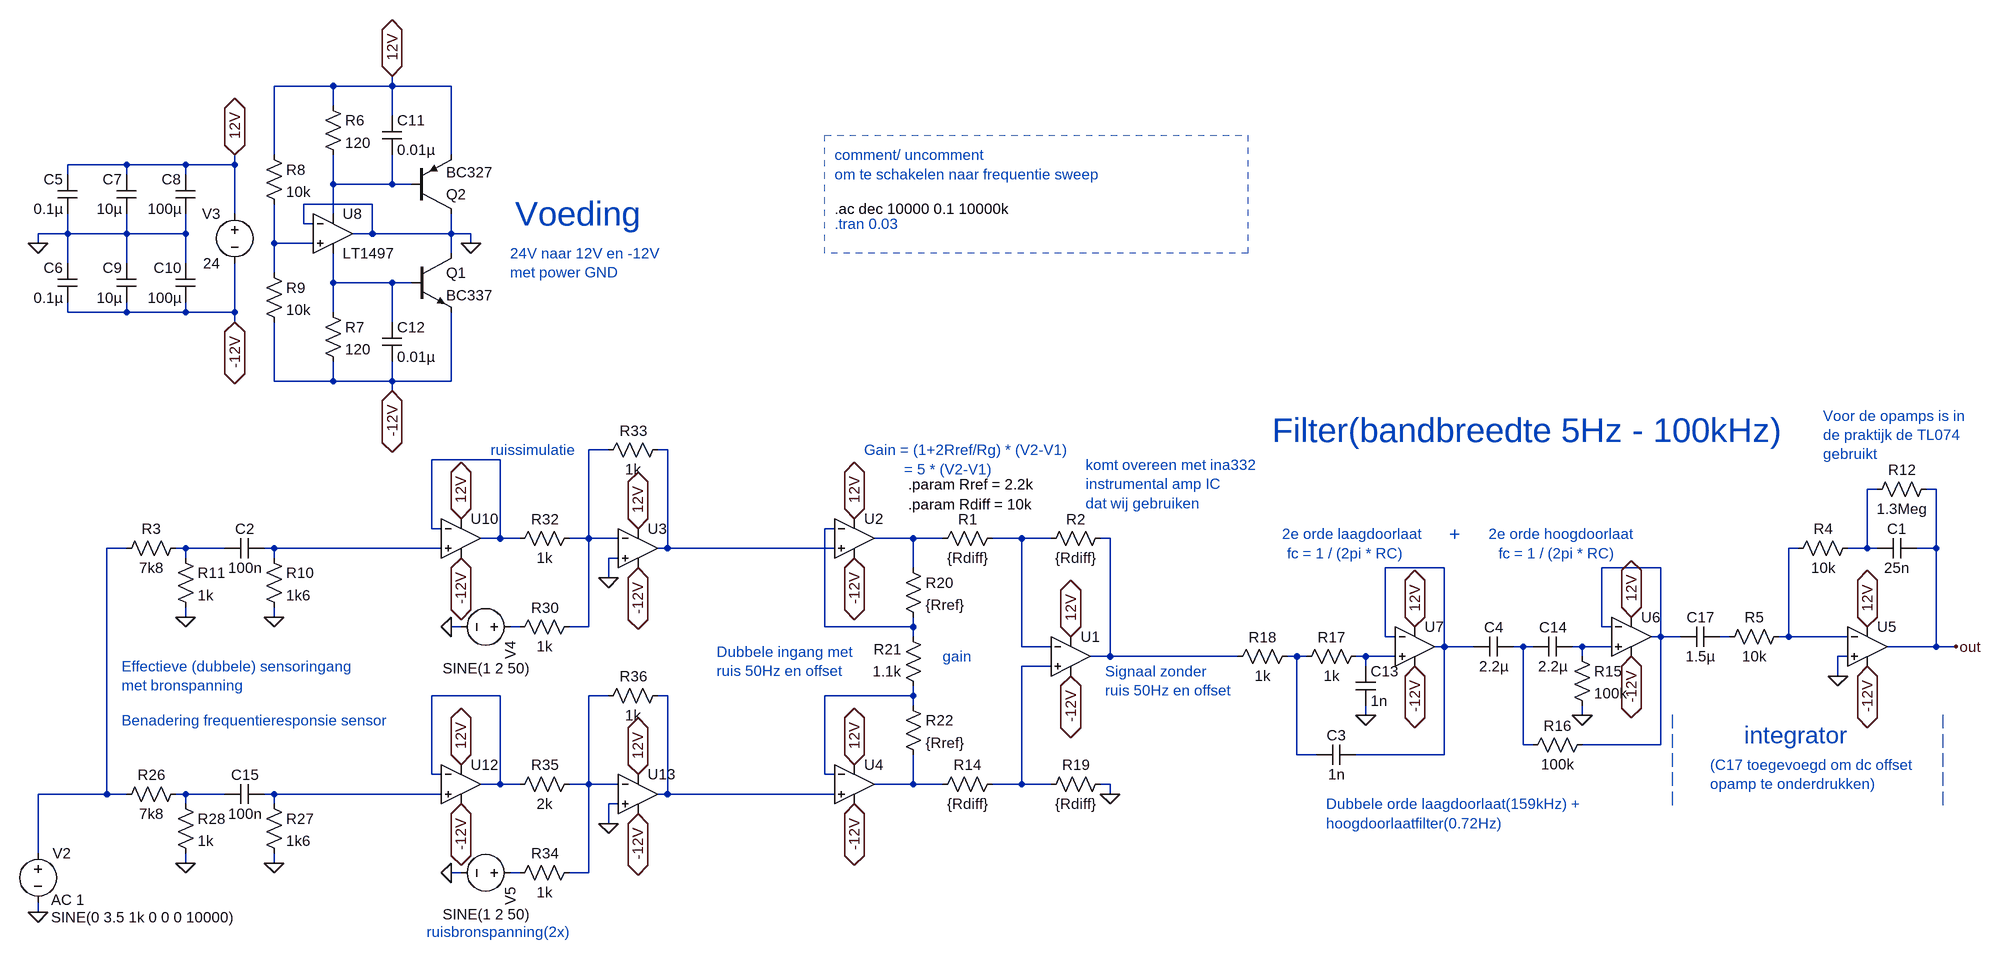
[diagram p0: schematic sensorsimulatie _5hz100khz_diff.asc]
sensorsimulatie _5hz100khz_diff.asc, the LTspice schematic file:
Version 4
SHEET 1 2408 680
WIRE -3392 -944 -3488 -944
WIRE -3296 -944 -3296 -960
WIRE -3296 -944 -3392 -944
WIRE -3200 -944 -3296 -944
WIRE -3392 -912 -3392 -944
WIRE -3296 -896 -3296 -944
WIRE -3488 -832 -3488 -944
WIRE -3200 -832 -3200 -944
WIRE -3728 -816 -3824 -816
WIRE -3632 -816 -3728 -816
WIRE -3552 -816 -3552 -832
WIRE -3552 -816 -3632 -816
WIRE -3824 -800 -3824 -816
WIRE -3728 -800 -3728 -816
WIRE -3632 -800 -3632 -816
WIRE -3392 -784 -3392 -832
WIRE -3296 -784 -3296 -832
WIRE -3296 -784 -3392 -784
WIRE -3264 -784 -3296 -784
WIRE -3328 -752 -3440 -752
WIRE -3552 -736 -3552 -816
WIRE -3392 -736 -3392 -784
WIRE -3440 -720 -3440 -752
WIRE -3424 -720 -3440 -720
WIRE -3824 -704 -3824 -736
WIRE -3824 -704 -3872 -704
WIRE -3728 -704 -3728 -736
WIRE -3728 -704 -3824 -704
WIRE -3632 -704 -3632 -736
WIRE -3632 -704 -3728 -704
WIRE -3328 -704 -3328 -752
WIRE -3328 -704 -3360 -704
WIRE -3200 -704 -3200 -736
WIRE -3200 -704 -3328 -704
WIRE -3168 -704 -3200 -704
WIRE -3872 -688 -3872 -704
WIRE -3488 -688 -3488 -752
WIRE -3424 -688 -3488 -688
WIRE -3168 -688 -3168 -704
WIRE -3200 -672 -3200 -704
WIRE -3824 -656 -3824 -704
WIRE -3728 -656 -3728 -704
WIRE -3632 -656 -3632 -704
WIRE -3488 -640 -3488 -688
WIRE -3392 -624 -3392 -672
WIRE -3296 -624 -3392 -624
WIRE -3264 -624 -3296 -624
WIRE -3824 -576 -3824 -592
WIRE -3728 -576 -3728 -592
WIRE -3728 -576 -3824 -576
WIRE -3632 -576 -3632 -592
WIRE -3632 -576 -3728 -576
WIRE -3552 -576 -3552 -656
WIRE -3552 -576 -3632 -576
WIRE -3392 -576 -3392 -624
WIRE -3552 -560 -3552 -576
WIRE -3296 -560 -3296 -624
WIRE -3488 -464 -3488 -560
WIRE -3392 -464 -3392 -496
WIRE -3392 -464 -3488 -464
WIRE -3296 -464 -3296 -496
WIRE -3296 -464 -3392 -464
WIRE -3200 -464 -3200 -576
WIRE -3200 -464 -3296 -464
WIRE -3296 -448 -3296 -464
WIRE -2944 -352 -2976 -352
WIRE -2848 -352 -2864 -352
WIRE -3120 -336 -3232 -336
WIRE -880 -288 -896 -288
WIRE -784 -288 -800 -288
WIRE -3232 -224 -3232 -336
WIRE -3216 -224 -3232 -224
WIRE -2576 -224 -2592 -224
WIRE -3120 -208 -3120 -336
WIRE -3120 -208 -3152 -208
WIRE -3088 -208 -3120 -208
WIRE -2976 -208 -2976 -352
WIRE -2976 -208 -3008 -208
WIRE -2928 -208 -2976 -208
WIRE -2448 -208 -2512 -208
WIRE -2400 -208 -2448 -208
WIRE -2272 -208 -2320 -208
WIRE -2224 -208 -2272 -208
WIRE -2128 -208 -2144 -208
WIRE -3728 -192 -3760 -192
WIRE -3632 -192 -3648 -192
WIRE -3568 -192 -3632 -192
WIRE -3488 -192 -3504 -192
WIRE -3216 -192 -3488 -192
WIRE -2848 -192 -2848 -352
WIRE -2848 -192 -2864 -192
WIRE -2576 -192 -2848 -192
WIRE -1008 -192 -1024 -192
WIRE -896 -192 -896 -288
WIRE -896 -192 -928 -192
WIRE -880 -192 -896 -192
WIRE -784 -192 -784 -288
WIRE -784 -192 -816 -192
WIRE -3632 -176 -3632 -192
WIRE -3488 -176 -3488 -192
WIRE -2928 -176 -2944 -176
WIRE -2448 -160 -2448 -208
WIRE -1584 -160 -1680 -160
WIRE -1232 -160 -1328 -160
WIRE -2944 -144 -2944 -176
WIRE -3632 -80 -3632 -96
WIRE -3488 -80 -3488 -96
WIRE -3184 -64 -3200 -64
WIRE -3088 -64 -3104 -64
WIRE -2976 -64 -2976 -208
WIRE -2976 -64 -3008 -64
WIRE -2592 -64 -2592 -224
WIRE -2448 -64 -2448 -80
WIRE -2448 -64 -2592 -64
WIRE -1328 -64 -1328 -160
WIRE -1312 -64 -1328 -64
WIRE -2448 -48 -2448 -64
WIRE -1680 -48 -1680 -160
WIRE -1664 -48 -1680 -48
WIRE -1232 -48 -1232 -160
WIRE -1232 -48 -1248 -48
WIRE -1200 -48 -1232 -48
WIRE -1120 -48 -1136 -48
WIRE -1024 -48 -1024 -192
WIRE -1024 -48 -1040 -48
WIRE -928 -48 -1024 -48
WIRE -2272 -32 -2272 -208
WIRE -2224 -32 -2272 -32
WIRE -1584 -32 -1584 -160
WIRE -1584 -32 -1600 -32
WIRE -1536 -32 -1584 -32
WIRE -1456 -32 -1472 -32
WIRE -1440 -32 -1456 -32
WIRE -1360 -32 -1376 -32
WIRE -1312 -32 -1360 -32
WIRE -784 -32 -784 -192
WIRE -784 -32 -864 -32
WIRE -752 -32 -784 -32
WIRE -2128 -16 -2128 -208
WIRE -2128 -16 -2160 -16
WIRE -1920 -16 -2128 -16
WIRE -1824 -16 -1840 -16
WIRE -1808 -16 -1824 -16
WIRE -1712 -16 -1728 -16
WIRE -1664 -16 -1712 -16
WIRE -1360 -16 -1360 -32
WIRE -928 -16 -944 -16
WIRE -2224 0 -2272 0
WIRE -1712 0 -1712 -16
WIRE -944 16 -944 -16
WIRE -3120 48 -3232 48
WIRE -2944 48 -2976 48
WIRE -2848 48 -2864 48
WIRE -2448 48 -2448 32
WIRE -2448 48 -2592 48
WIRE -2448 64 -2448 48
WIRE -1712 80 -1712 64
WIRE -1360 80 -1360 64
WIRE -1456 128 -1456 -32
WIRE -1440 128 -1456 128
WIRE -1232 128 -1232 -48
WIRE -1232 128 -1360 128
WIRE -1824 144 -1824 -16
WIRE -1792 144 -1824 144
WIRE -1584 144 -1584 -32
WIRE -1584 144 -1728 144
WIRE -3232 176 -3232 48
WIRE -3216 176 -3232 176
WIRE -2592 176 -2592 48
WIRE -2576 176 -2592 176
WIRE -3120 192 -3120 48
WIRE -3120 192 -3152 192
WIRE -3088 192 -3120 192
WIRE -2976 192 -2976 48
WIRE -2976 192 -3008 192
WIRE -2928 192 -2976 192
WIRE -2448 192 -2448 144
WIRE -2448 192 -2512 192
WIRE -2400 192 -2448 192
WIRE -2272 192 -2272 0
WIRE -2272 192 -2320 192
WIRE -2224 192 -2272 192
WIRE -2128 192 -2144 192
WIRE -3760 208 -3760 -192
WIRE -3760 208 -3872 208
WIRE -3728 208 -3760 208
WIRE -3632 208 -3648 208
WIRE -3568 208 -3632 208
WIRE -3488 208 -3504 208
WIRE -3216 208 -3488 208
WIRE -2848 208 -2848 48
WIRE -2848 208 -2864 208
WIRE -2576 208 -2848 208
WIRE -2128 208 -2128 192
WIRE -3632 224 -3632 208
WIRE -3488 224 -3488 208
WIRE -2928 224 -2944 224
WIRE -2944 256 -2944 224
WIRE -3872 304 -3872 208
WIRE -3632 320 -3632 304
WIRE -3488 320 -3488 304
WIRE -3184 336 -3200 336
WIRE -3088 336 -3104 336
WIRE -2976 336 -2976 192
WIRE -2976 336 -3008 336
WIRE -3872 400 -3872 384
FLAG -3552 -832 12V
IOPIN -3552 -832 BiDir
FLAG -3552 -560 -12V
IOPIN -3552 -560 BiDir
FLAG -3872 -688 0
FLAG -3488 -80 0
FLAG -3632 -80 0
FLAG -3872 400 0
FLAG -1280 -80 12V
IOPIN -1280 -80 BiDir
FLAG -1280 -16 -12V
IOPIN -1280 -16 BiDir
FLAG -1360 80 0
FLAG -3168 -688 0
FLAG -3296 -960 12V
IOPIN -3296 -960 BiDir
FLAG -3296 -448 -12V
IOPIN -3296 -448 BiDir
FLAG -944 16 0
FLAG -896 -64 12V
IOPIN -896 -64 BiDir
FLAG -896 0 -12V
IOPIN -896 0 BiDir
FLAG -1632 -64 12V
IOPIN -1632 -64 BiDir
FLAG -1632 0 -12V
IOPIN -1632 0 BiDir
FLAG -1712 80 0
FLAG -752 -32 out
FLAG -2192 -48 12V
IOPIN -2192 -48 BiDir
FLAG -2192 16 -12V
IOPIN -2192 16 BiDir
FLAG -2544 160 12V
IOPIN -2544 160 BiDir
FLAG -2544 224 -12V
IOPIN -2544 224 BiDir
FLAG -2128 208 0
FLAG -2544 -176 -12V
IOPIN -2544 -176 BiDir
FLAG -2544 -240 12V
IOPIN -2544 -240 BiDir
FLAG -3488 320 0
FLAG -3632 320 0
FLAG -3200 -64 0
FLAG -3184 -240 12V
IOPIN -3184 -240 BiDir
FLAG -3184 -176 -12V
IOPIN -3184 -176 BiDir
FLAG -3184 160 12V
IOPIN -3184 160 BiDir
FLAG -3184 224 -12V
IOPIN -3184 224 BiDir
FLAG -2944 -144 0
FLAG -2896 -224 12V
IOPIN -2896 -224 BiDir
FLAG -2896 -160 -12V
IOPIN -2896 -160 BiDir
FLAG -2944 256 0
FLAG -2896 176 12V
IOPIN -2896 176 BiDir
FLAG -2896 240 -12V
IOPIN -2896 240 BiDir
FLAG -3200 336 0
SYMBOL voltage -3552 -752 M0
SYMATTR InstName V3
SYMATTR Value 24
SYMBOL cap -3808 -800 M0
SYMATTR InstName C5
SYMATTR Value 0.1µ
SYMBOL cap -3808 -656 M0
SYMATTR InstName C6
SYMATTR Value 0.1µ
SYMBOL cap -3712 -800 M0
SYMATTR InstName C7
SYMATTR Value 10µ
SYMBOL cap -3616 -800 M0
SYMATTR InstName C8
SYMATTR Value 100µ
SYMBOL cap -3712 -656 M0
SYMATTR InstName C9
SYMATTR Value 10µ
SYMBOL cap -3616 -656 M0
SYMATTR InstName C10
SYMATTR Value 100µ
SYMBOL res -3408 -928 R0
SYMATTR InstName R6
SYMATTR Value 120
SYMBOL cap -3312 -896 R0
SYMATTR InstName C11
SYMATTR Value 0.01µ
SYMBOL res -3408 -592 R0
SYMATTR InstName R7
SYMATTR Value 120
SYMBOL cap -3312 -560 R0
SYMATTR InstName C12
SYMATTR Value 0.01µ
SYMBOL res -3504 -848 R0
SYMATTR InstName R8
SYMATTR Value 10k
SYMBOL res -3504 -656 R0
SYMATTR InstName R9
SYMATTR Value 10k
SYMBOL npn -3264 -672 R0
SYMATTR InstName Q1
SYMATTR Value BC337
SYMBOL pnp -3264 -736 M180
SYMATTR InstName Q2
SYMATTR Value BC327
SYMBOL cap -816 -208 R90
WINDOW 0 0 32 VBottom 2
WINDOW 3 32 32 VTop 2
SYMATTR InstName C1
SYMATTR Value 25n
SYMBOL res -912 -208 R90
WINDOW 0 0 56 VBottom 2
WINDOW 3 32 56 VTop 2
SYMATTR InstName R4
SYMATTR Value 10k
SYMBOL res -1024 -64 R90
WINDOW 0 0 56 VBottom 2
WINDOW 3 32 56 VTop 2
SYMATTR InstName R5
SYMATTR Value 10k
SYMBOL res -3632 -208 R90
WINDOW 0 0 56 VBottom 2
WINDOW 3 32 56 VTop 2
SYMATTR InstName R3
SYMATTR Value 7k8
SYMBOL res -3504 -192 R0
SYMATTR InstName R10
SYMATTR Value 1k6
SYMBOL res -3648 -192 R0
SYMATTR InstName R11
SYMATTR Value 1k
SYMBOL cap -3504 -208 R90
WINDOW 0 0 32 VBottom 2
WINDOW 3 32 32 VTop 2
SYMATTR InstName C2
SYMATTR Value 100n
SYMBOL res -784 -304 R90
WINDOW 0 0 56 VBottom 2
WINDOW 3 32 56 VTop 2
SYMATTR InstName R12
SYMATTR Value 1.3Meg
SYMBOL voltage -3872 288 R0
WINDOW 3 21 120 Left 2
WINDOW 123 21 92 Left 2
WINDOW 39 0 0 Left 0
SYMATTR Value SINE(0 3.5 1k 0 0 0 10000)
SYMATTR Value2 AC 1
SYMATTR InstName V2
SYMBOL cap -1472 -48 R90
WINDOW 0 0 32 VBottom 2
WINDOW 3 32 32 VTop 2
SYMATTR InstName C4
SYMATTR Value 2.2µ
SYMBOL cap -1376 -48 R90
WINDOW 0 0 32 VBottom 2
WINDOW 3 32 32 VTop 2
SYMATTR InstName C14
SYMATTR Value 2.2µ
SYMBOL res -1376 -32 R0
SYMATTR InstName R15
SYMATTR Value 100k
SYMBOL res -1344 112 R90
WINDOW 0 0 56 VBottom 2
WINDOW 3 32 56 VTop 2
SYMATTR InstName R16
SYMATTR Value 100k
SYMBOL cap -1728 128 R90
WINDOW 0 0 32 VBottom 2
WINDOW 3 32 32 VTop 2
SYMATTR InstName C3
SYMATTR Value 1n
SYMBOL cap -1728 0 R0
SYMATTR InstName C13
SYMATTR Value 1n
SYMBOL res -1712 -32 R90
WINDOW 0 0 56 VBottom 2
WINDOW 3 32 56 VTop 2
SYMATTR InstName R17
SYMATTR Value 1k
SYMBOL res -1824 -32 R90
WINDOW 0 0 56 VBottom 2
WINDOW 3 32 56 VTop 2
SYMATTR InstName R18
SYMATTR Value 1k
SYMBOL res -2304 -224 R90
WINDOW 0 0 56 VBottom 2
WINDOW 3 32 56 VTop 2
SYMATTR InstName R1
SYMATTR Value {Rdiff}
SYMBOL res -2128 -224 R90
WINDOW 0 0 56 VBottom 2
WINDOW 3 32 56 VTop 2
SYMATTR InstName R2
SYMATTR Value {Rdiff}
SYMBOL res -2304 176 R90
WINDOW 0 0 56 VBottom 2
WINDOW 3 32 56 VTop 2
SYMATTR InstName R14
SYMATTR Value {Rdiff}
SYMBOL res -2128 176 R90
WINDOW 0 0 56 VBottom 2
WINDOW 3 32 56 VTop 2
SYMATTR InstName R19
SYMATTR Value {Rdiff}
SYMBOL res -2464 -176 R0
SYMATTR InstName R20
SYMATTR Value {Rref}
SYMBOL res -2432 48 R180
WINDOW 0 36 76 Left 2
WINDOW 3 36 40 Left 2
SYMATTR InstName R21
SYMATTR Value 1.1k
SYMBOL res -2464 48 R0
SYMATTR InstName R22
SYMATTR Value {Rref}
SYMBOL res -3632 192 R90
WINDOW 0 0 56 VBottom 2
WINDOW 3 32 56 VTop 2
SYMATTR InstName R26
SYMATTR Value 7k8
SYMBOL res -3504 208 R0
SYMATTR InstName R27
SYMATTR Value 1k6
SYMBOL res -3648 208 R0
SYMATTR InstName R28
SYMATTR Value 1k
SYMBOL cap -3504 192 R90
WINDOW 0 0 32 VBottom 2
WINDOW 3 32 32 VTop 2
SYMATTR InstName C15
SYMATTR Value 100n
SYMBOL voltage -3088 -64 R90
WINDOW 3 67 -14 VRight 2
WINDOW 123 0 0 Left 0
WINDOW 39 0 0 Left 0
SYMATTR Value SINE(1 2 50)
SYMATTR InstName V4
SYMBOL res -2992 -80 R90
WINDOW 0 0 56 VBottom 2
WINDOW 3 32 56 VTop 2
SYMATTR InstName R30
SYMATTR Value 1k
SYMBOL OpAmps\\UniversalOpamp2 -2896 -192 R0
SYMATTR InstName U3
SYMBOL res -2992 -224 R90
WINDOW 0 0 56 VBottom 2
WINDOW 3 32 56 VTop 2
SYMATTR InstName R32
SYMATTR Value 1k
SYMBOL OpAmps\\UniversalOpamp2 -3184 -208 R0
SYMATTR InstName U10
SYMBOL OpAmps\\UniversalOpamp2 -3184 192 R0
SYMATTR InstName U12
SYMBOL res -2848 -368 R90
WINDOW 0 0 56 VBottom 2
WINDOW 3 32 56 VTop 2
SYMATTR InstName R33
SYMATTR Value 1k
SYMBOL res -2992 320 R90
WINDOW 0 0 56 VBottom 2
WINDOW 3 32 56 VTop 2
SYMATTR InstName R34
SYMATTR Value 1k
SYMBOL OpAmps\\UniversalOpamp2 -2896 208 R0
SYMATTR InstName U13
SYMBOL res -2992 176 R90
WINDOW 0 0 56 VBottom 2
WINDOW 3 32 56 VTop 2
SYMATTR InstName R35
SYMATTR Value 2k
SYMBOL res -2848 32 R90
WINDOW 0 0 56 VBottom 2
WINDOW 3 32 56 VTop 2
SYMATTR InstName R36
SYMATTR Value 1k
SYMBOL voltage -3088 336 R90
WINDOW 3 67 -14 VRight 2
WINDOW 123 0 0 Left 0
WINDOW 39 0 0 Left 0
SYMATTR Value SINE(1 2 50)
SYMATTR InstName V5
SYMBOL cap -1136 -64 R90
WINDOW 0 0 32 VBottom 2
WINDOW 3 32 32 VTop 2
SYMATTR InstName C17
SYMATTR Value 1.5µ
SYMBOL OpAmps\\LT1497 -3392 -768 R0
SYMATTR InstName U8
SYMBOL OpAmps\\UniversalOpamp2 -2192 -16 R0
SYMATTR InstName U1
SYMBOL OpAmps\\UniversalOpamp2 -2544 -208 R0
SYMATTR InstName U2
SYMBOL OpAmps\\UniversalOpamp2 -2544 192 R0
SYMATTR InstName U4
SYMBOL OpAmps\\UniversalOpamp2 -896 -32 R0
SYMATTR InstName U5
SYMBOL OpAmps\\UniversalOpamp2 -1280 -48 R0
SYMATTR InstName U6
SYMBOL OpAmps\\UniversalOpamp2 -1632 -32 R0
SYMATTR InstName U7
TEXT -2576 -744 Left 2 !.ac dec 10000 0.1 10000k
TEXT -3096 -736 Left 5 ;Voeding
TEXT -1864 -384 Left 5 ;Filter(bandbreedte 5Hz - 100kHz)
TEXT -3104 -672 Left 2 ;24V naar 12V en -12V\nmet power GND
TEXT -3736 88 Left 2 ;Benadering frequentieresponsie sensor
TEXT -1496 -184 Left 2 ;fc = 1 / (2pi * RC)
TEXT -1776 224 Left 2 ;Dubbele orde laagdoorlaat(159kHz) +\nhoogdoorlaatfilter(0.72Hz)
TEXT -2400 -16 Left 2 ;gain
TEXT -2456 -264 Left 2 !.param Rdiff = 10k
TEXT -2456 -296 Left 2 !.param Rref = 2.2k
TEXT -2528 -352 Left 2 ;Gain = (1+2Rref/Rg) * (V2-V1)\n          = 5 * (V2-V1)
TEXT -2768 -24 Left 2 ;Dubbele ingang met \nruis 50Hz en offset
TEXT -3736 0 Left 2 ;Effectieve (dubbele) sensoringang\nmet bronspanning
TEXT -3136 -352 Left 2 ;ruissimulatie
TEXT -1840 -184 Left 2 ;fc = 1 / (2pi * RC)
TEXT -1848 -216 Left 2 ;2e orde laagdoorlaat
TEXT -1512 -216 Left 2 ;2e orde hoogdoorlaat
TEXT -1576 -216 Left 3 ;+
TEXT -2136 8 Left 2 ;Signaal zonder \nruis 50Hz en offset
TEXT -3240 432 Left 2 ;ruisbronspanning(2x)
TEXT -2168 -328 Left 2 ;komt overeen met ina332\ninstrumental amp IC\ndat wij gebruiken
TEXT -1096 112 Left 4 ;integrator
TEXT -1216 88 Left 2 ;|\n|\n|\n|\n|
TEXT -776 88 Left 2 ;|\n|\n|\n|\n|
TEXT -1152 160 Left 2 ;(C17 toegevoegd om dc offset\nopamp te onderdrukken)
TEXT -968 -408 Left 2 ;Voor de opamps is in\nde praktijk de TL074\ngebruikt
TEXT -2576 -720 Left 2 ;.tran 0.03
TEXT -2576 -832 Left 2 ;comment/ uncomment \nom te schakelen naar frequentie sweep
RECTANGLE Normal -1904 -672 -2592 -864 2

The netlist it stands for:
* sensorsimulatie _5hz100khz_diff.asc
V3 12V -12V 24
C5 12V 0 0.1µ
C6 0 -12V 0.1µ
C7 12V 0 10µ
C8 12V 0 100µ
C9 0 -12V 10µ
C10 0 -12V 100µ
R6 12V N001 120
C11 12V N001 0.01µ
R7 N003 -12V 120
C12 N003 -12V 0.01µ
R8 12V N002 10k
R9 N002 -12V 10k
Q1 0 N003 -12V 0 BC337
Q2 0 N001 12V 0 BC327
C1 out N007 25n
R4 N007 N015 10k
R5 N015 N019 10k
R3 N013 N012 7k8
R10 N014 0 1k6
R11 N013 0 1k
C2 N014 N013 100n
R12 out N007 1.3Meg
V2 N012 0 SINE(0 3.5 1k 0 0 0 10000) AC 1
C4 N020 N016 2.2µ
C14 N021 N020 2.2µ
R15 N021 0 100k
R16 N017 N020 100k
C3 N016 N022 1n
C13 N023 0 1n
R17 N023 N022 1k
R18 N022 N011 1k
R1 N010 N009 {Rdiff}
R2 N011 N010 {Rdiff}
R14 N024 N029 {Rdiff}
R19 0 N024 {Rdiff}
R20 N009 N008 {Rref}
R21 N028 N008 1.1k
R22 N028 N029 {Rref}
R26 N030 N012 7k8
R27 N031 0 1k6
R28 N030 0 1k
C15 N031 N030 100n
V4 N018 0 SINE(1 2 50)
R30 N004 N018 1k
XU3 0 N004 12V -12V N005 level.2 Avol=1Meg GBW=10Meg Slew=10Meg ilimit=25m rail=0 Vos=0 phimargin=45 en=0 enk=0 in=0 ink=0 Rin=500Meg  ; pins IN+ IN- V+ V- OUT
R32 N004 N006 1k
XU10 N014 N006 12V -12V N006 level.2 Avol=1Meg GBW=10Meg Slew=10Meg ilimit=25m rail=0 Vos=0 phimargin=45 en=0 enk=0 in=0 ink=0 Rin=500Meg  ; pins IN+ IN- V+ V- OUT
XU12 N031 N025 12V -12V N025 level.2 Avol=1Meg GBW=10Meg Slew=10Meg ilimit=25m rail=0 Vos=0 phimargin=45 en=0 enk=0 in=0 ink=0 Rin=500Meg  ; pins IN+ IN- V+ V- OUT
R33 N005 N004 1k
R34 N026 N032 1k
XU13 0 N026 12V -12V N027 level.2 Avol=1Meg GBW=10Meg Slew=10Meg ilimit=25m rail=0 Vos=0 phimargin=45 en=0 enk=0 in=0 ink=0 Rin=500Meg  ; pins IN+ IN- V+ V- OUT
R35 N026 N025 2k
R36 N027 N026 1k
V5 N032 0 SINE(1 2 50)
C17 N019 N017 1.5µ
XU8 N002 0 N001 N003 0 LT1497  ; pins In+ In- V+ V- OUT
XU1 N024 N010 12V -12V N011 level.2 Avol=1Meg GBW=10Meg Slew=10Meg ilimit=25m rail=0 Vos=0 phimargin=45 en=0 enk=0 in=0 ink=0 Rin=500Meg  ; pins IN+ IN- V+ V- OUT
XU2 N005 N008 12V -12V N009 level.2 Avol=1Meg GBW=10Meg Slew=10Meg ilimit=25m rail=0 Vos=0 phimargin=45 en=0 enk=0 in=0 ink=0 Rin=500Meg  ; pins IN+ IN- V+ V- OUT
XU4 N027 N028 12V -12V N029 level.2 Avol=1Meg GBW=10Meg Slew=10Meg ilimit=25m rail=0 Vos=0 phimargin=45 en=0 enk=0 in=0 ink=0 Rin=500Meg  ; pins IN+ IN- V+ V- OUT
XU5 0 N015 12V -12V out level.2 Avol=1Meg GBW=10Meg Slew=10Meg ilimit=25m rail=0 Vos=0 phimargin=45 en=0 enk=0 in=0 ink=0 Rin=500Meg  ; pins IN+ IN- V+ V- OUT
XU6 N021 N017 12V -12V N017 level.2 Avol=1Meg GBW=10Meg Slew=10Meg ilimit=25m rail=0 Vos=0 phimargin=45 en=0 enk=0 in=0 ink=0 Rin=500Meg  ; pins IN+ IN- V+ V- OUT
XU7 N023 N016 12V -12V N016 level.2 Avol=1Meg GBW=10Meg Slew=10Meg ilimit=25m rail=0 Vos=0 phimargin=45 en=0 enk=0 in=0 ink=0 Rin=500Meg  ; pins IN+ IN- V+ V- OUT
.model NPN NPN
.model PNP PNP
.lib standard.bjt
.ac dec 10000 0.1 10000k
* Voeding
* Filter(bandbreedte 5Hz - 100kHz)
* 24V naar 12V en -12V
* met power GND
* Benadering frequentieresponsie sensor
* fc = 1 / (2pi * RC)
* Dubbele orde laagdoorlaat(159kHz) +
* hoogdoorlaatfilter(0.72Hz)
* gain
.param Rdiff = 10k
.param Rref = 2.2k
* Gain = (1+2Rref/Rg) * (V2-V1)
*           = 5 * (V2-V1)
* Dubbele ingang met
* ruis 50Hz en offset
* Effectieve (dubbele) sensoringang
* met bronspanning
* ruissimulatie
* fc = 1 / (2pi * RC)
* 2e orde laagdoorlaat
* 2e orde hoogdoorlaat
* +
* Signaal zonder
* ruis 50Hz en offset
* ruisbronspanning(2x)
* komt overeen met ina332
* instrumental amp IC
* dat wij gebruiken
* integrator
* |
* |
* |
* |
* |
* |
* |
* |
* |
* |
* (C17 toegevoegd om dc offset
* opamp te onderdrukken)
* Voor de opamps is in
* de praktijk de TL074
* gebruikt
* .tran 0.03
* comment/ uncomment
* om te schakelen naar frequentie sweep
.lib UniversalOpamps2.sub
.backanno
.end